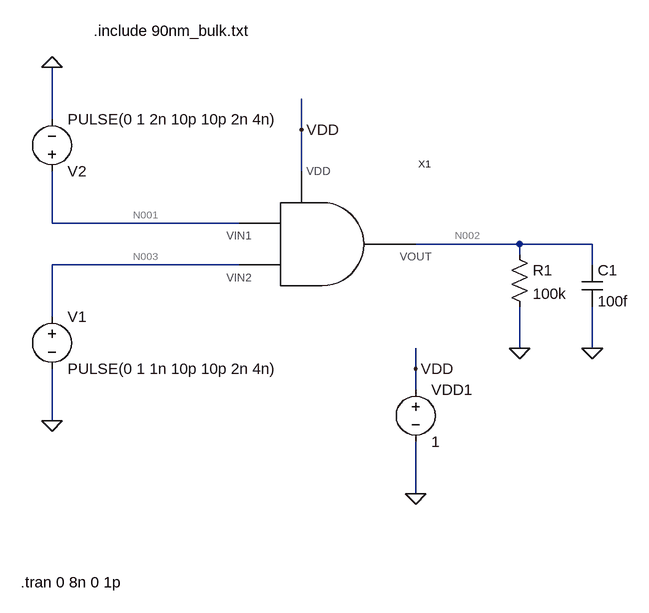
[diagram p0: schematic AND_tb.asc]
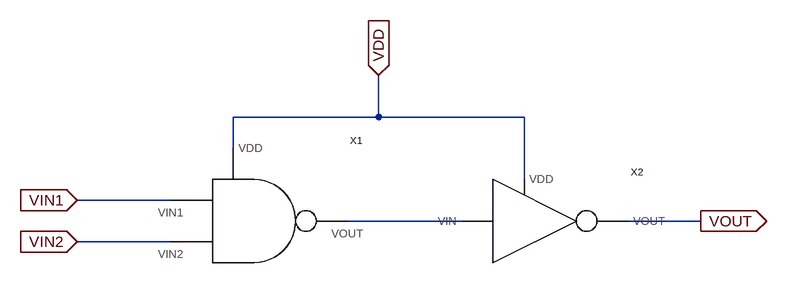
[diagram p1: sub-circuit and.asc]
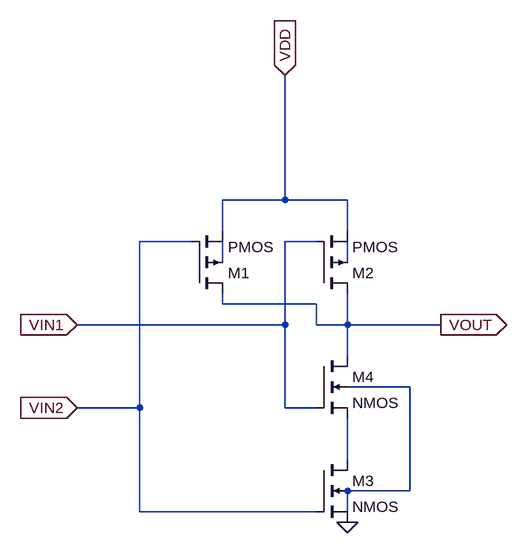
[diagram p2: sub-circuit nand.asc]
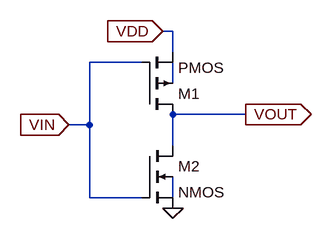
[diagram p3: sub-circuit not.asc]
AND_tb.asc, the LTspice schematic file:
Version 4
SHEET 1 880 680
WIRE -368 -160 -368 -240
WIRE 16 -144 16 -192
WIRE 16 -80 16 -144
WIRE -368 0 -368 -80
WIRE -80 0 -368 0
WIRE 352 32 192 32
WIRE 464 32 352 32
WIRE 352 48 352 32
WIRE -80 64 -368 64
WIRE 464 64 464 32
WIRE -368 144 -368 64
WIRE 352 192 352 128
WIRE 464 192 464 128
WIRE 192 224 192 192
WIRE 192 256 192 224
WIRE -368 304 -368 224
WIRE 192 416 192 336
FLAG 192 416 0
FLAG 192 224 VDD
FLAG 352 192 0
FLAG 464 192 0
FLAG 16 -144 VDD
FLAG -368 304 0
FLAG -368 -240 0
SYMBOL voltage -368 128 R0
WINDOW 123 0 0 Left 0
WINDOW 39 0 0 Left 0
SYMATTR InstName V1
SYMATTR Value PULSE(0 1 1n 10p 10p 2n 4n)
SYMBOL res 336 32 R0
SYMATTR InstName R1
SYMATTR Value 100k
SYMBOL cap 448 64 R0
SYMATTR InstName C1
SYMATTR Value 100f
SYMBOL voltage 192 240 R0
WINDOW 123 0 0 Left 0
WINDOW 39 0 0 Left 0
SYMATTR InstName VDD1
SYMATTR Value 1
SYMBOL voltage -368 -64 M180
WINDOW 123 0 0 Left 0
WINDOW 39 0 0 Left 0
SYMATTR InstName V2
SYMATTR Value PULSE(0 1 2n 10p 10p 2n 4n)
SYMBOL AND 32 32 R0
SYMATTR InstName X1
TEXT -304 -296 Left 2 !.include 90nm_bulk.txt
TEXT -416 552 Left 2 !.tran 0 8n 0 1p

and.asc, the sub-circuit schematic file:
Version 4
SHEET 1 880 680
WIRE 176 32 176 -32
WIRE 176 32 -48 32
WIRE 400 32 176 32
WIRE -48 80 -48 32
WIRE 400 128 400 32
WIRE -144 160 -288 160
WIRE 304 192 128 192
WIRE 672 192 560 192
WIRE -144 224 -288 224
FLAG -288 160 VIN1
IOPIN -288 160 In
FLAG -288 224 VIN2
IOPIN -288 224 In
FLAG 176 -32 VDD
IOPIN 176 -32 In
FLAG 672 192 VOUT
IOPIN 672 192 Out
SYMBOL NAND -32 192 R0
SYMATTR InstName X1
SYMBOL NOT 400 192 R0
SYMATTR InstName X2

nand.asc, the sub-circuit schematic file:
Version 4
SHEET 1 880 680
WIRE 32 -64 32 -256
WIRE 32 -64 -64 -64
WIRE 128 -64 32 -64
WIRE -64 -16 -64 -64
WIRE 128 -16 128 -64
WIRE -112 0 -192 0
WIRE 80 0 32 0
WIRE -64 32 -64 0
WIRE 128 32 128 0
WIRE -64 96 -64 80
WIRE 80 96 -64 96
WIRE 32 128 32 0
WIRE 32 128 -288 128
WIRE 80 128 80 96
WIRE 128 128 128 80
WIRE 128 128 80 128
WIRE 272 128 128 128
WIRE 128 176 128 128
WIRE 224 224 128 224
WIRE -192 256 -192 0
WIRE -192 256 -288 256
WIRE 32 256 32 128
WIRE 80 256 32 256
WIRE 128 336 128 272
WIRE 224 384 224 224
WIRE 224 384 128 384
WIRE -192 416 -192 256
WIRE 80 416 -192 416
WIRE 128 416 128 384
FLAG 128 432 0
FLAG -288 128 VIN1
IOPIN -288 128 In
FLAG -288 256 VIN2
IOPIN -288 256 In
FLAG 32 -256 VDD
IOPIN 32 -256 In
FLAG 272 128 VOUT
IOPIN 272 128 Out
SYMBOL pmos4 -112 80 M180
SYMATTR InstName M1
SYMATTR Value2 l=90n w=400n
SYMBOL pmos4 80 80 M180
SYMATTR InstName M2
SYMATTR Value2 l=90n w=400n
SYMBOL nmos4 80 336 R0
SYMATTR InstName M3
SYMATTR Value2 l=90n w=200n
SYMBOL nmos4 80 176 R0
SYMATTR InstName M4
SYMATTR Value2 l=90n w=200n

not.asc, the sub-circuit schematic file:
Version 4
SHEET 1 880 680
WIRE 208 16 192 16
WIRE 208 48 208 16
WIRE 160 64 80 64
WIRE 208 96 208 64
WIRE 320 144 208 144
WIRE 80 160 80 64
WIRE 80 160 48 160
WIRE 208 192 208 144
WIRE 80 272 80 160
WIRE 160 272 80 272
WIRE 208 272 208 240
FLAG 48 160 VIN
IOPIN 48 160 In
FLAG 320 144 VOUT
IOPIN 320 144 Out
FLAG 192 16 VDD
IOPIN 192 16 In
FLAG 208 288 0
SYMBOL pmos4 160 144 M180
SYMATTR InstName M1
SYMATTR Value2 l=90n w=400n
SYMBOL nmos4 160 192 R0
SYMATTR InstName M2
SYMATTR Value2 l=90n w=200n

The netlist it stands for:
* AND_tb.asc
V1 N003 0 PULSE(0 1 1n 10p 10p 2n 4n)
R1 N002 0 100k
C1 N002 0 100f
VDD1 VDD 0 1
V2 N001 0 PULSE(0 1 2n 10p 10p 2n 4n)
XX1 VDD N001 N002 N003 and

* block symbol definitions
.subckt and VDD VIN1 VOUT VIN2
XX1 VDD VIN1 N001 VIN2 nand
XX2 N001 VOUT VDD not
.ends and

.subckt nand VDD VIN1 VOUT VIN2
M1 VOUT VIN2 VDD N001 PMOS l=90n w=400n
M2 VOUT VIN1 VDD N002 PMOS l=90n w=400n
M3 N004 VIN2 0 N003 NMOS l=90n w=200n
M4 VOUT VIN1 N004 N003 NMOS l=90n w=200n
.ends nand

.subckt not VIN VOUT VDD
M1 VOUT VIN VDD N001 PMOS l=90n w=400n
M2 VOUT VIN 0 N002 NMOS l=90n w=200n
.ends not

.model NMOS NMOS
.model PMOS PMOS
.lib standard.mos
.include 90nm_bulk.txt
.tran 0 8n 0 1p
.backanno
.end

* Results of the author's LTspice run, read from the files saved beside the schematic
* Operating Point, zero values left out:
*   V(n002) = 55.6 µV
*   V(vdd) = 1 V
*   I(R1) = 556 pA
*   I(V2) = 130.9 pA
*   I(Vdd1) = -40.17 nA
*   I(V1) = 2.931 pA
*   Ix(x1:VDD) = 40.17 nA
*   Ix(x1:VIN1) = -130.9 pA
*   Ix(x1:VOUT) = -556 pA
*   Ix(x1:VIN2) = -2.931 pA
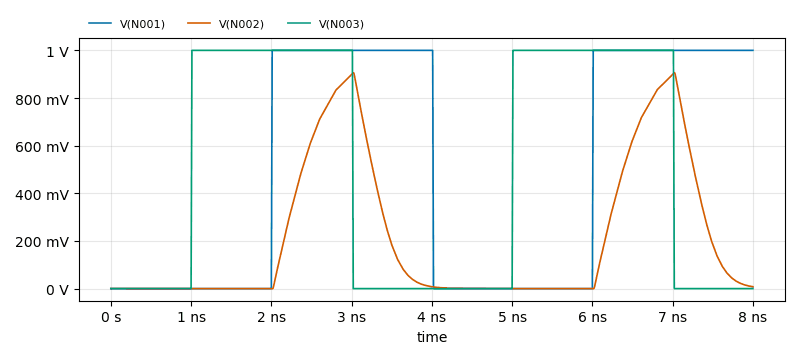
[diagram p4: Transient Analysis of AND_tb.asc, plotted from the saved traces]
* Transient Analysis, 1 run:
*   V(N001): min 0 V, max 1 V, average 500.6 mV, rms 707.1 mV, last 1 V
*   V(N002): min -883.9 µV, max 906.2 mV, average 213.3 mV, rms 373.8 mV, last 7.732 mV
*   V(N003): min 0 V, max 1 V, average 502.5 mV, rms 708.3 mV, last 0 V